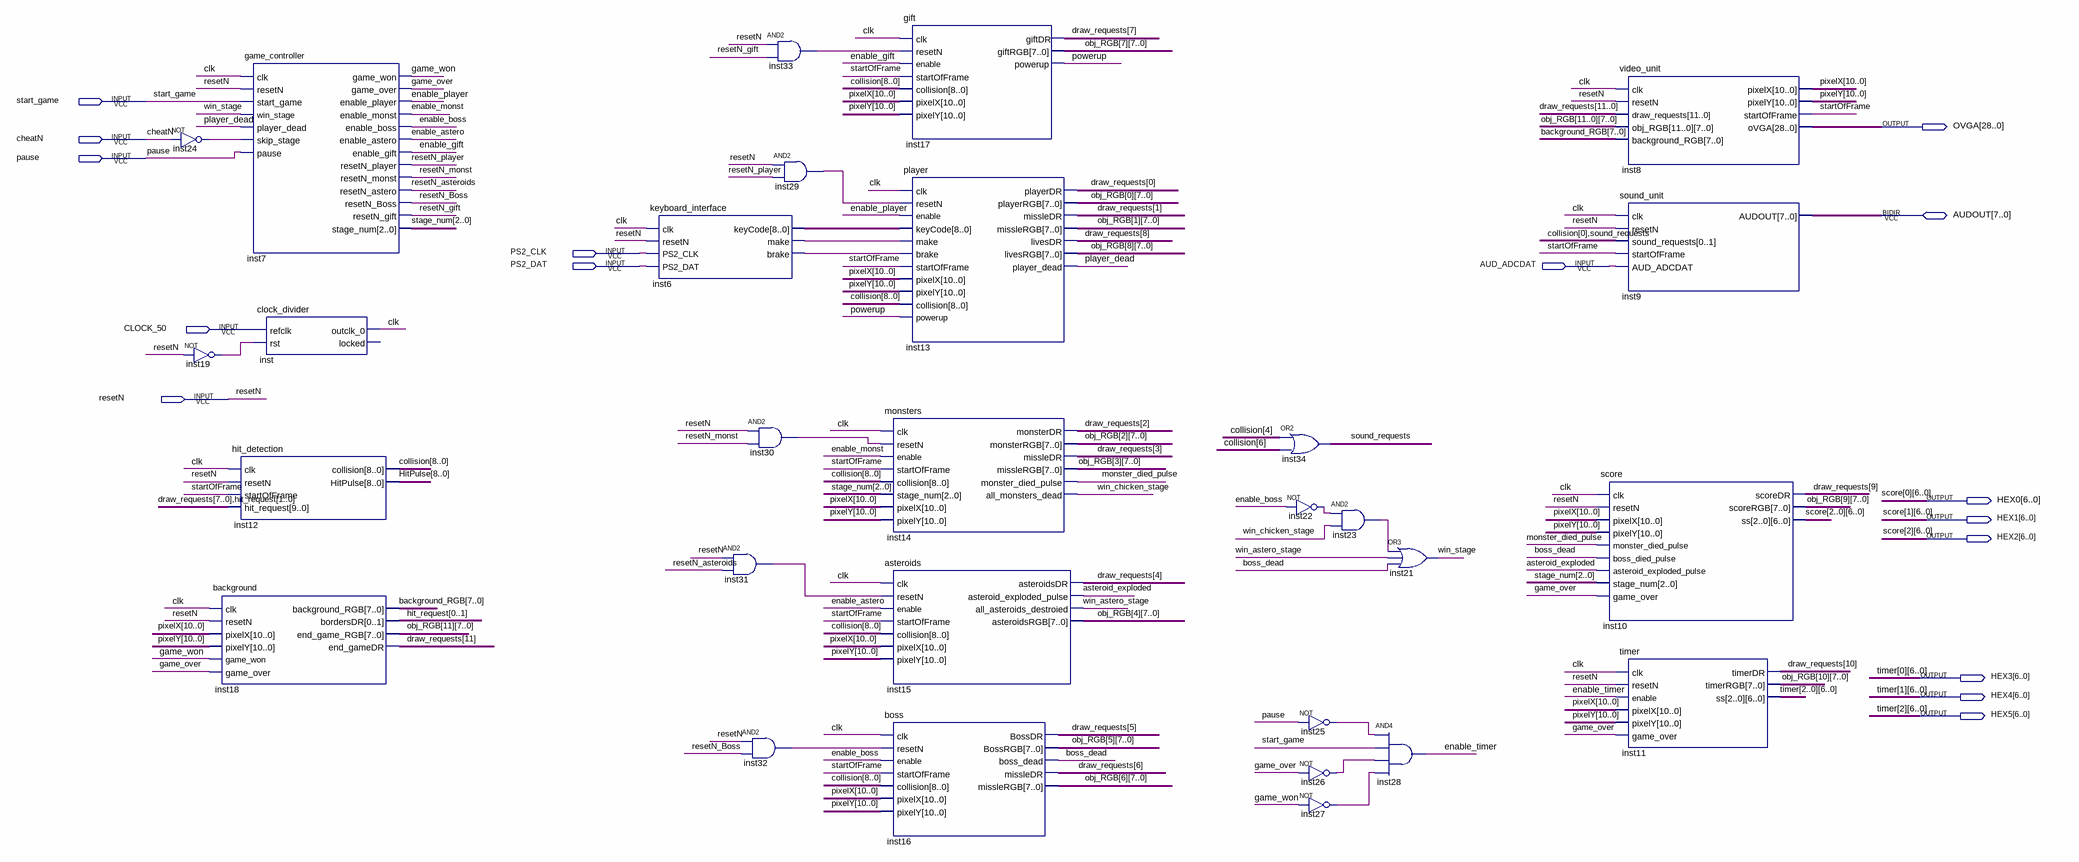
[diagram p0: schematic sheet]
// Quartus schematic TOP_DIAGRAM.bdf as structural Verilog: 29 symbols, 16 pins
module TOP_DIAGRAM (
  input  start_game,
  input  cheatN,
  input  pause,
  input  PS2_CLK,
  input  PS2_DAT,
  input  AUD_ADCDAT,
  input  CLOCK_50,
  input  resetN,
  inout  [7:0] AUDOUT,
  output [28:0] OVGA,
  output [6:0] HEX0,
  output [6:0] HEX1,
  output [6:0] HEX2,
  output [6:0] HEX3,
  output [6:0] HEX4,
  output [6:0] HEX5
);

  wire asteroid_exploded, boss_dead, clk, enable_astero, enable_boss, enable_gift, enable_monst,
       enable_player, enable_timer, game_over, game_won, inst6_brake, inst6_make, inst19_out, inst22_out,
       inst23_out, inst24_out, inst25_out, inst26_out, inst27_out, inst29_out, inst30_out, inst31_out,
       inst32_out, inst33_out, monster_died_pulse, player_dead, powerup, resetN_asteroids, resetN_Boss,
       resetN_gift, resetN_monst, resetN_player, sound_requests, startOfFrame, win_astero_stage,
       win_chicken_stage, win_stage;
  wire [1:0] hit_request;
  wire [2:0] stage_num;
  wire [7:0] background_RGB, obj_RGB_0, obj_RGB_1, obj_RGB_2, obj_RGB_3, obj_RGB_4, obj_RGB_5, obj_RGB_6,
       obj_RGB_7, obj_RGB_8, obj_RGB_9, obj_RGB_10, obj_RGB_11;
  wire [8:0] collision, HitPulse, inst6_keycode;
  wire [10:0] pixelX, pixelY;
  wire [11:0] draw_requests;

  not inst24 (inst24_out, cheatN);
  not inst19 (inst19_out, resetN);
  game_controller inst7 (
    .clk(clk), .resetN(resetN), .start_game(start_game), .win_stage(win_stage), .player_dead(player_dead),
    .skip_stage(inst24_out), .pause(pause), .game_won(game_won), .game_over(game_over),
    .enable_player(enable_player), .enable_monst(enable_monst), .enable_boss(enable_boss),
    .enable_astero(enable_astero), .enable_gift(enable_gift), .resetN_player(resetN_player),
    .resetN_monst(resetN_monst), .resetN_astero(resetN_asteroids), .resetN_Boss(resetN_Boss),
    .resetN_gift(resetN_gift), .stage_num(stage_num));
  clock_divider inst (.refclk(CLOCK_50), .rst(inst19_out), .outclk_0(clk));  // open: locked
  hit_detection inst12 (
    .clk(clk), .resetN(resetN), .startOfFrame(startOfFrame), .hit_request({draw_requests[7:0], hit_request}),
    .collision(collision), .HitPulse(HitPulse));
  background inst18 (
    .clk(clk), .resetN(resetN), .pixelX(pixelX), .pixelY(pixelY), .game_won(game_won), .game_over(game_over),
    .background_RGB(background_RGB), .bordersDR({hit_request[0], hit_request[1]}), .end_game_RGB(obj_RGB_11),
    .end_gameDR(draw_requests[11]));
  keyboard_interface inst6 (
    .clk(clk), .resetN(resetN), .PS2_CLK(PS2_CLK), .PS2_DAT(PS2_DAT), .keyCode(inst6_keycode),
    .make(inst6_make), .brake(inst6_brake));
  and inst30 (inst30_out, resetN, resetN_monst);
  and inst31 (inst31_out, resetN, resetN_asteroids);
  and inst32 (inst32_out, resetN, resetN_Boss);
  and inst33 (inst33_out, resetN, resetN_gift);
  and inst29 (inst29_out, resetN, resetN_player);
  gift inst17 (
    .clk(clk), .resetN(inst33_out), .enable(enable_gift), .startOfFrame(startOfFrame), .collision(collision),
    .pixelX(pixelX), .pixelY(pixelY), .giftDR(draw_requests[7]), .giftRGB(obj_RGB_7), .powerup(powerup));
  player inst13 (
    .clk(clk), .resetN(inst29_out), .enable(enable_player), .keyCode(inst6_keycode), .make(inst6_make),
    .brake(inst6_brake), .startOfFrame(startOfFrame), .pixelX(pixelX), .pixelY(pixelY),
    .collision(collision), .powerup(powerup), .playerDR(draw_requests[0]), .playerRGB(obj_RGB_0),
    .missleDR(draw_requests[1]), .missleRGB(obj_RGB_1), .livesDR(draw_requests[8]), .livesRGB(obj_RGB_8),
    .player_dead(player_dead));
  monsters inst14 (
    .clk(clk), .resetN(inst30_out), .enable(enable_monst), .startOfFrame(startOfFrame),
    .collision(collision), .stage_num(stage_num), .pixelX(pixelX), .pixelY(pixelY),
    .monsterDR(draw_requests[2]), .monsterRGB(obj_RGB_2), .missleDR(draw_requests[3]), .missleRGB(obj_RGB_3),
    .monster_died_pulse(monster_died_pulse), .all_monsters_dead(win_chicken_stage));
  asteroids inst15 (
    .clk(clk), .resetN(inst31_out), .enable(enable_astero), .startOfFrame(startOfFrame),
    .collision(collision), .pixelX(pixelX), .pixelY(pixelY), .asteroidsDR(draw_requests[4]),
    .asteroid_exploded_pulse(asteroid_exploded), .all_asteroids_destroied(win_astero_stage),
    .asteroidsRGB(obj_RGB_4));
  boss inst16 (
    .clk(clk), .resetN(inst32_out), .enable(enable_boss), .startOfFrame(startOfFrame), .collision(collision),
    .pixelX(pixelX), .pixelY(pixelY), .BossDR(draw_requests[5]), .BossRGB(obj_RGB_5), .boss_dead(boss_dead),
    .missleDR(draw_requests[6]), .missleRGB(obj_RGB_6));
  or inst34 (sound_requests, collision[4], collision[6]);
  not inst22 (inst22_out, enable_boss);
  not inst25 (inst25_out, pause);
  not inst26 (inst26_out, game_over);
  not inst27 (inst27_out, game_won);
  and inst23 (inst23_out, inst22_out, win_chicken_stage);
  or inst21 (win_stage, inst23_out, win_astero_stage, boss_dead);
  and inst28 (enable_timer, inst25_out, start_game, inst26_out, inst27_out);
  video_unit inst8 (
    .clk(clk), .resetN(resetN), .draw_requests(draw_requests),
    .obj_RGB({obj_RGB_11, obj_RGB_10, obj_RGB_9, obj_RGB_8, obj_RGB_7, obj_RGB_6, obj_RGB_5, obj_RGB_4, obj_RGB_3, obj_RGB_2, obj_RGB_1, obj_RGB_0}),
    .background_RGB(background_RGB), .pixelX(pixelX), .pixelY(pixelY), .startOfFrame(startOfFrame),
    .oVGA(OVGA));
  sound_unit inst9 (
    .clk(clk), .resetN(resetN), .sound_requests({collision[0], sound_requests}), .startOfFrame(startOfFrame),
    .AUD_ADCDAT(AUD_ADCDAT), .AUDOUT(AUDOUT));
  score inst10 (
    .clk(clk), .resetN(resetN), .pixelX(pixelX), .pixelY(pixelY), .monster_died_pulse(monster_died_pulse),
    .boss_died_pulse(boss_dead), .asteroid_exploded_pulse(asteroid_exploded), .stage_num(stage_num),
    .game_over(game_over), .scoreDR(draw_requests[9]), .scoreRGB(obj_RGB_9), .ss({HEX2, HEX1, HEX0}));
  timer inst11 (
    .clk(clk), .resetN(resetN), .enable(enable_timer), .pixelX(pixelX), .pixelY(pixelY),
    .game_over(game_over), .timerDR(draw_requests[10]), .timerRGB(obj_RGB_10), .ss({HEX5, HEX4, HEX3}));

  // Other names for the same wires on the sheet: score_0[6:0] = HEX0; score_1[6:0] = HEX1; score_2[6:0] = HEX2;
  //   timer_0[6:0] = HEX3; timer_1[6:0] = HEX4; timer_2[6:0] = HEX5
endmodule
